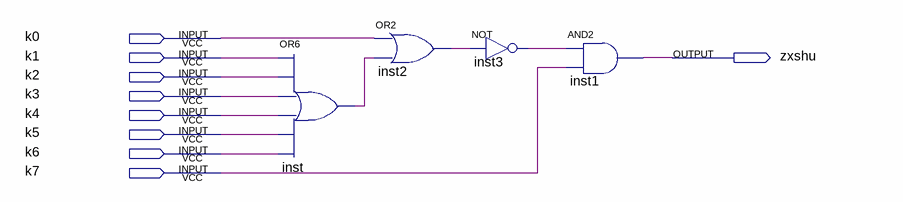
[diagram p0: schematic sheet]
// Quartus schematic zxshu.bdf as structural Verilog: 4 symbols, 9 pins
module zxshu (
  input  k0,
  input  k1,
  input  k2,
  input  k3,
  input  k4,
  input  k5,
  input  k6,
  input  k7,
  output zxshu
);

  wire inst2_out, inst3_out, inst_out;

  or inst (inst_out, k1, k2, k3, k4, k5, k6);
  or inst2 (inst2_out, k0, inst_out);
  not inst3 (inst3_out, inst2_out);
  and inst1 (zxshu, inst3_out, k7);
endmodule
